# Altium schematic sheet DamperDividerBoard.SchDoc
size B
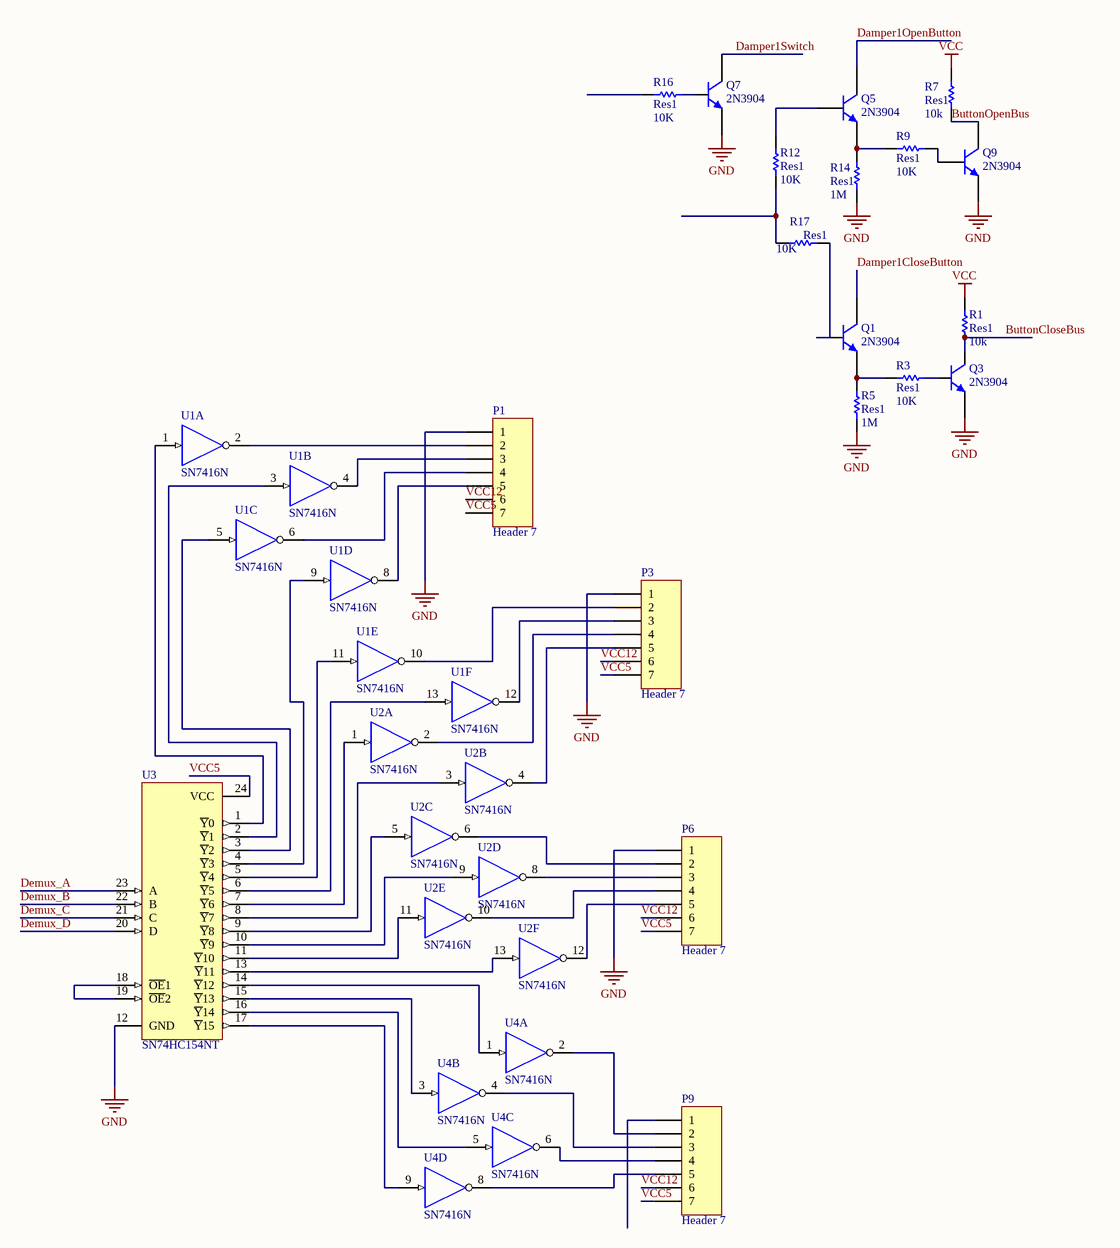
[diagram p0: DamperDividerBoard.SchDoc]

## Parts
P1  Header 7  [HDR1X7]
P3  Header 7  [HDR1X7]
P6  Header 7  [HDR1X7]
P9  Header 7  [HDR1X7]
Q1  2N3904  [2N3904]
Q3  2N3904  [2N3904]
Q5  2N3904  [2N3904]
Q7  2N3904  [2N3904]
Q9  2N3904  [2N3904]
R1  Res1  value 10k  [AXIAL-0.3]
R3  Res1  value 10K  [AXIAL-0.3]
R5  Res1  value 1M  [AXIAL-0.3]
R7  Res1  value 10k  [AXIAL-0.3]
R9  Res1  value 10K  [AXIAL-0.3]
R12  Res1  value 10K  [AXIAL-0.3]
R14  Res1  value 1M  [AXIAL-0.3]
R16  Res1  value 10K  [AXIAL-0.3]
R17  Res1  value 10K  [AXIAL-0.3]
U1  SN7416N  [N014]  (parts A,B,C,D,E,F of 6)
U2  SN7416N  [N014]  (parts A,B,C,D,E,F of 6)
U3  SN74HC154NT  [NT024D]
U4  SN7416N  [N014]  (parts A,B,C,D of 6)

## Nets
GND: P1.1 P3.1 P6.1 Q3.1(E) Q7.1(E) Q9.1(E) R5.1 R14.1 U1.7(GND) U2.7(GND) U3.12(GND) U4.7(GND)
VCC: R1.2 R7.2 U1.14(VCC) U2.14(VCC) U4.14(VCC5)
ButtonCloseBus: Q3.3(C) R1.1
ButtonOpenBus: Q9.3(C) R7.1
Damper1CloseButton: Q1.3(C)
Damper1OpenButton: Q5.3(C)
Damper1Switch: Q7.3(C)
Demux_A: U3.23(A)
Demux_B: U3.22(B)
Demux_C: U3.21(C)
Demux_D: U3.20(D)
VCC5: P1.7 P3.7 P6.7 P9.7 U3.24(VCC)
VCC12: P1.6 P3.6 P6.6 P9.6
NetP1_2: P1.2 U1.2(Y)
NetP1_3: P1.3 U1.4(Y)
NetP1_4: P1.4 U1.6(Y)
NetP1_5: P1.5 U1.8(Y)
NetP3_2: P3.2 U1.10(Y)
NetP3_3: P3.3 U1.12(Y)
NetP3_4: P3.4 U2.2(Y)
NetP3_5: P3.5 U2.4(Y)
NetP6_2: P6.2 U2.6(Y)
NetP6_3: P6.3 U2.8(Y)
NetP6_4: P6.4 U2.10(Y)
NetP6_5: P6.5 U2.12(Y)
NetP9_2: P9.2 U4.2(Y)
NetP9_3: P9.3 U4.4(Y)
NetP9_4: P9.4 U4.6(Y)
NetP9_5: P9.5 U4.8(Y)
NetQ1_1: Q1.1(E) R3.1 R5.2
NetQ1_2: Q1.2(B) R17.2
NetQ3_2: Q3.2(B) R3.2
NetQ5_1: Q5.1(E) R9.1 R14.2
NetQ5_2: Q5.2(B) R12.2
NetQ7_2: Q7.2(B) R16.2
NetQ9_2: Q9.2(B) R9.2
NetR12_1: R12.1 R17.1
NetU1_1: U1.1(A) U3.1(~{Y}0)
NetU1_3: U1.3(A) U3.2(~{Y}1)
NetU1_5: U1.5(A) U3.3(~{Y}2)
NetU1_9: U1.9(A) U3.4(~{Y}3)
NetU1_11: U1.11(A) U3.5(~{Y}4)
NetU1_13: U1.13(A) U3.6(~{Y}5)
NetU2_1: U2.1(A) U3.7(~{Y}6)
NetU2_3: U2.3(A) U3.8(~{Y}7)
NetU2_5: U2.5(A) U3.9(~{Y}8)
NetU2_9: U2.9(A) U3.10(~{Y}9)
NetU2_11: U2.11(A) U3.11(~{Y}10)
NetU2_13: U2.13(A) U3.13(~{Y}11)
NetU3_14: U3.14(~{Y}12) U4.1(A)
NetU3_15: U3.15(~{Y}13) U4.3(A)
NetU3_16: U3.16(~{Y}14) U4.5(A)
NetU3_17: U3.17(~{Y}15) U4.9(A)
NetU3_18: U3.18(~{OE}1) U3.19(~{OE}2)

Not connected (* = marked no-connect by the designer): P9 1; R16 1

## Notes on the sheet
- Title
- Size:
- Date:
- B
- Number:
- Time:
- Revision:
- Sheet
- of
- File:

## Library data of the parts
P1 P3 P6 P9 = Header 7: Header, 7-Pin; LatestRevisionDate: 17-Jul-2002; LatestRevisionNote: Re-released for DXP Platform.; Publisher: Altium Limited
Q1 Q3 Q5 Q7 Q9 = 2N3904: NPN General Purpose Amplifier; Published: 8-Jun-2000; LatestRevisionDate: 15-Jan-2003; LatestRevisionNote: PCB Footprint 'BCY-W3/D4.7' replaced; DatasheetVersion: 1997; PackageVersion: Sep-1998; PackageReference: TO-92A; Publisher: Altium Limited; PackageDescription: TO, Flat Index; 3 In-Line, Axial Leads; Body Dia. 4.5mm; Leads 0.51 x 0.48 mm (max); ComponentLink1Description: Manufacturer Link; ComponentLink1URL: http://www.fairchildsemi.com/; ComponentLink2Description: Datasheet; ComponentLink2URL: http://www.fairchildsemi.com/ds/2N%2F2N3904.pdf
R1 R3 R5 R7 R9 R12 R14 R16 R17 = Res1: Resistor; Published: 8-Jun-2000; LatestRevisionDate: 17-Jul-2002; LatestRevisionNote: Re-released for DXP Platform.; PackageReference: AXIAL-0.3; Publisher: Altium Limited; PackageDescription: Axial Device, Thru-Hole; 2 Leads; 0.3 in Pin Spacing
U1 U2 U4 = SN7416N: Hex Inverter Buffer / Driver with High-Voltage Outputs; Published: 8-Jun-2000; LatestRevisionDate: 04-Mar-2005; LatestRevisionNote: Stylized 3D Model Added.; DatasheetVersion: Mar-1988; PackageVersion: Oct-1995; PackageReference: N014; Publisher: Altium Limited; PackageDescription: DIP; 14 Leads; Row Spacing 7.62 mm; Pitch 2.54 mm; ComponentLink1Description: Manufacturer Link; ComponentLink1URL: http://www.ti.com/; ComponentLink2Description: Datasheet; ComponentLink2URL: http://www-s.ti.com/sc/ds/sn5416.pdf; ComponentLink3Description: Packaging Specification; ComponentLink3URL: http://focus.ti.com/lit/ml/mpdi002c/mpdi002c.pdf
U3 = SN74HC154NT: 4-Line to 16-Line Decoder / Demultiplexer; ComponentAvailability: Obsolete; Published: 8-Jun-2000; LatestRevisionDate: 04-Mar-2005; LatestRevisionNote: Stylized 3D Model Added.; DatasheetVersion: Sep-1987; PackageVersion: Oct-1994; PackageReference: NT024D; Publisher: Altium Limited; PackageDescription: DIP; 24 Leads; Row Spacing 7.62 mm; Pitch 2.54 mm; Code_JEDEC: MS-001-AF; ComponentLink1Description: Manufacturer Link; ComponentLink1URL: http://www.ti.com/; ComponentLink2Description: Discontinuation Notice; ComponentLink2URL: http://focus.ti.com/docs/prod/folders/print/sn74hc154.html